# Altium schematic sheet main.SchDoc
size A4
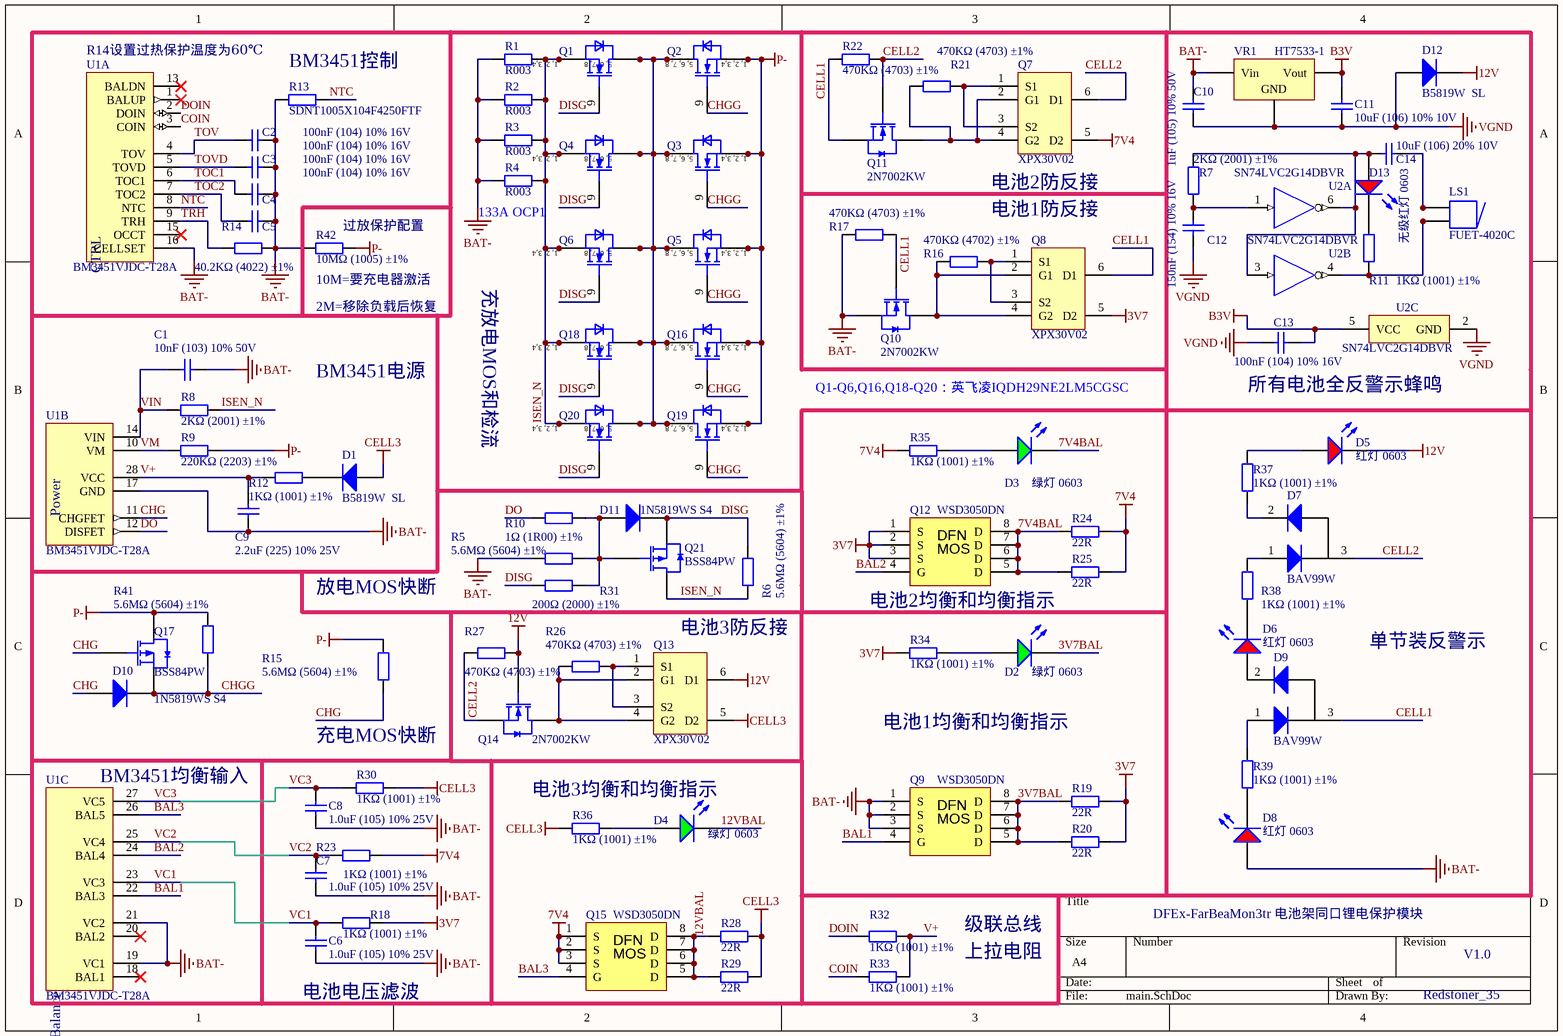
[diagram p0: main.SchDoc]

## Parts
C1  10nF (103) 10% 50V  [0402_C]
C2  100nF (104) 10% 16V  [0402_C]
C3  100nF (104) 10% 16V  [0402_C]
C4  100nF (104) 10% 16V  [0402_C]
C5  100nF (104) 10% 16V  [0402_C]
C6  1.0uF (105) 10% 25V  [0402_C]
C7  1.0uF (105) 10% 25V  [0402_C]
C8  1.0uF (105) 10% 25V  [0402_C]
C9  2.2uF (225) 10% 25V  [0402_C]
C10  1uF (105) 10% 50V  [0603_C]
C11  10uF (106) 10% 10V  [0603_C]
C12  150nF (154) 10% 16V  [0402_C]
C13  100nF (104) 10% 16V  [0402_C]
C14  10uF (106) 20% 10V  [0402_C]
D1  B5819W  SL  [SOD-123]
D2  绿灯 0603  [0603_LED_S1]
D3  绿灯 0603  [0603_LED_S1]
D4  绿灯 0603  [0603_LED_S1]
D5  红灯 0603  [0603_LED_S1]
D6  红灯 0603  [0603_LED_S1]
D7  BAV99W  [SC70-3]
D8  红灯 0603  [0603_LED_S1]
D9  BAV99W  [SC70-3]
D10  1N5819WS S4  [SOD-323]
D11  1N5819WS S4  [SOD-323]
D12  B5819W  SL  [SOD-123]
D13  无级红灯 0603  [0603_LED_S1]
LS1  FUET-4020C  [FUET-4020C]
Q1  IQDH29NE2LM5CGSC  [IFX-PG-WHTFN-9-2-V]  (value not drawn)
Q2  IQDH29NE2LM5CGSC  [IFX-PG-WHTFN-9-2-V]  (value not drawn)
Q3  IQDH29NE2LM5CGSC  [IFX-PG-WHTFN-9-2-V]  (value not drawn)
Q4  IQDH29NE2LM5CGSC  [IFX-PG-WHTFN-9-2-V]  (value not drawn)
Q5  IQDH29NE2LM5CGSC  [IFX-PG-WHTFN-9-2-V]  (value not drawn)
Q6  IQDH29NE2LM5CGSC  [IFX-PG-WHTFN-9-2-V]  (value not drawn)
Q7  XPX30V02  [EDFN3x3]
Q8  XPX30V02  [EDFN3x3]
Q9  WSD3050DN  [DFN-8_L3.0-W3.0-P0.65-BL]
Q10  2N7002KW  [SC70-3]
Q11  2N7002KW  [SC70-3]
Q12  WSD3050DN  [DFN-8_L3.0-W3.0-P0.65-BL]
Q13  XPX30V02  [EDFN3x3]
Q14  2N7002KW  [SC70-3]
Q15  WSD3050DN  [DFN-8_L3.0-W3.0-P0.65-BL]
Q16  IQDH29NE2LM5CGSC  [IFX-PG-WHTFN-9-2-V]  (value not drawn)
Q17  BSS84PW  [SC70-3]
Q18  IQDH29NE2LM5CGSC  [IFX-PG-WHTFN-9-2-V]  (value not drawn)
Q19  IQDH29NE2LM5CGSC  [IFX-PG-WHTFN-9-2-V]  (value not drawn)
Q20  IQDH29NE2LM5CGSC  [IFX-PG-WHTFN-9-2-V]  (value not drawn)
Q21  BSS84PW  [SC70-3]
R1  R003  [2512]
R2  R003  [2512]
R3  R003  [2512]
R4  R003  [2512]
R5  5.6MΩ (5604) ±1%  [0402_R]
R6  5.6MΩ (5604) ±1%  [0402_R]
R7  2KΩ (2001) ±1%  [0402_R]
R8  2KΩ (2001) ±1%  [0402_R]
R9  220KΩ (2203) ±1%  [0402_R]
R10  1Ω (1R00) ±1%  [0402_R]
R11  1KΩ (1001) ±1%  [0402_R]
R12  1KΩ (1001) ±1%  [0805_R]
R13  SDNT1005X104F4250FTF  [0402_R]
R14  40.2KΩ (4022) ±1%  [0402_R]
R15  5.6MΩ (5604) ±1%  [0402_R]
R16  470KΩ (4702) ±1%  [0402_R]
R17  470KΩ (4703) ±1%  [0402_R]
R18  1KΩ (1001) ±1%  [0402_R]
R19  22R  [1210R]
R20  22R  [1210R]
R21  470KΩ (4703) ±1%  [0402_R]
R22  470KΩ (4703) ±1%  [0402_R]
R23  1KΩ (1001) ±1%  [0402_R]
R24  22R  [1210R]
R25  22R  [1210R]
R26  470KΩ (4703) ±1%  [0402_R]
R27  470KΩ (4703) ±1%  [0402_R]
R28  22R  [1210R]
R29  22R  [1210R]
R30  1KΩ (1001) ±1%  [0402_R]
R31  200Ω (2000) ±1%  [0402_R]
R32  1KΩ (1001) ±1%  [0402_R]
R33  1KΩ (1001) ±1%  [0402_R]
R34  1KΩ (1001) ±1%  [0402_R]
R35  1KΩ (1001) ±1%  [0402_R]
R36  1KΩ (1001) ±1%  [0402_R]
R37  1KΩ (1001) ±1%  [0402_R]
R38  1KΩ (1001) ±1%  [0402_R]
R39  1KΩ (1001) ±1%  [0402_R]
R41  5.6MΩ (5604) ±1%  [0402_R]
R42  10MΩ (1005) ±1%  [0402_R]
U1  BM3451VJDC-T28A  [TSSOP28-BM3451]  (parts A,B,C of 3)
U2  SN74LVC2G14DBVR  [DBV0006A_N]  (parts A,B,C of 3)
VR1  HT7533-1  [SOT-89(SOT-89-3)]

## Nets
3V7: Q8.5(D2) Q12.1(S) Q12.2(S) Q12.3(S) R18.2 R19.1 R20.1 R34.1
7V4: Q7.5(D2) Q15.1(S) Q15.2(S) Q15.3(S) R23.2 R24.1 R25.1 R35.1
12V: D5.K D12.2(K) Q13.6(D1) Q14.1(G) R27.2
B3V: C11.2 C13.1 U2.5(VCC) VR1.3(Vout)
BAT-: C1.2 C2.2 C3.2 C4.2 C5.2 C6.1 C7.1 C8.1 C9.1 C10.2 D8.A Q9.1(S) Q9.2(S) Q9.3(S) Q10.2(S) R1.2 R2.2 R3.2 R4.2 R5.2 R13.2 R14.2 R17.1 R42.1 U1.16(CELLSET) U1.17(GND) U1.19(VC1) U1.21(VC2) VR1.2(Vin)
CELL3: D1.1(A) Q13.5(D2) R28.1 R29.1 R30.2 R36.1
P-: Q2.1(SOURCE1) Q2.2(SOURCE2) Q2.3(SOURCE3) Q2.4(SOURCE4) Q3.1(SOURCE1) Q3.2(SOURCE2) Q3.3(SOURCE3) Q3.4(SOURCE4) Q5.1(SOURCE1) Q5.2(SOURCE2) Q5.3(SOURCE3) Q5.4(SOURCE4) Q16.1(SOURCE1) Q16.2(SOURCE2) Q16.3(SOURCE3) Q16.4(SOURCE4) Q17.3(D) Q19.1(SOURCE1) Q19.2(SOURCE2) Q19.3(SOURCE3) Q19.4(SOURCE4) R9.2 R15.2 R41.2 R42.2
VGND: C10.1 C11.1 C12.2 C13.2 D12.1(A) U2.2(GND) VR1.1(GND)
3V7BAL: D2.K Q9.5(D) Q9.6(D) Q9.7(D) Q9.8(D) R19.2 R20.2
7V4BAL: D3.K Q12.5(D) Q12.6(D) Q12.7(D) Q12.8(D) R24.2 R25.2
12VBAL: D4.K Q15.5(D) Q15.6(D) Q15.7(D) Q15.8(D) R28.2 R29.2
BAL1: Q9.4(G) U1.22(BAL3)
BAL2: Q12.4(G) U1.24(BAL4)
BAL3: Q15.4(G) U1.26(BAL5)
CELL1: D9.3(K) Q8.6(D1) Q10.1(G) Q11.2(S) R17.2 R22.1
CELL2: D7.3(K) Q7.6(D1) Q11.1(G) Q14.2(S) R22.2 R27.1
CHG: D10.1(A) Q17.1(G) R15.1 U1.11(CHGFET)
CHGG: D10.2(K) Q2.9(GATE) Q3.9(GATE) Q5.9(GATE) Q16.9(GATE) Q17.2(S) Q19.9(GATE) R41.1
COIN: R33.1 U1.3(COIN)
DISG: D11.2(K) Q1.9(GATE) Q4.9(GATE) Q6.9(GATE) Q18.9(GATE) Q20.9(GATE) Q21.2(S) R6.2 R31.1
DO: R10.1 U1.12(DISFET)
DOIN: R32.1 U1.2(DOIN)
ISEN_N: Q1.1(SOURCE1) Q1.2(SOURCE2) Q1.3(SOURCE3) Q1.4(SOURCE4) Q4.1(SOURCE1) Q4.2(SOURCE2) Q4.3(SOURCE3) Q4.4(SOURCE4) Q6.1(SOURCE1) Q6.2(SOURCE2) Q6.3(SOURCE3) Q6.4(SOURCE4) Q18.1(SOURCE1) Q18.2(SOURCE2) Q18.3(SOURCE3) Q18.4(SOURCE4) Q20.1(SOURCE1) Q20.2(SOURCE2) Q20.3(SOURCE3) Q20.4(SOURCE4) Q21.3(D) R1.1 R2.1 R3.1 R4.1 R6.1 R8.2
NTC: R13.1 U1.8(NTC)
TOC1: C4.1 U1.6(TOC1)
TOC2: C5.1 U1.7(TOC2)
TOV: C2.1 U1.4(TOV)
TOVD: C3.1 U1.5(TOVD)
TRH: R14.1 U1.9(TRH)
V+: C9.2 R12.1 R32.2 R33.2 U1.28(VCC)
VC1: C6.2 R18.1 U1.23(VC3)
VC2: C7.2 R23.1 U1.25(VC4)
VC3: C8.2 R30.1 U1.27(VC5)
VIN: C1.1 R8.1 U1.14(VIN)
VM: R9.1 U1.10(VM)
NetC12_1: C12.1 R7.1 U2.1(1A)
NetC14_1: C14.1 D13.A R7.2 U2.3(2A) U2.6(1Y)
NetC14_2: C14.2 LS1.2 LS1.2A
NetD1_2: D1.2(K) R12.2
NetD2_A: D2.A R34.2
NetD3_A: D3.A R35.2
NetD4_A: D4.A R36.2
NetD5_A: D5.A R37.2
NetD6_A: D6.A D9.2(A)
NetD6_K: D6.K R38.1
NetD7_1: D7.1(A) R38.2
NetD7_2: D7.2(A) R37.1
NetD8_K: D8.K R39.1
NetD9_1: D9.1(A) R39.2
NetD11_1: D11.1(A) Q21.1(G) R5.1 R10.2 R31.2
NetD13_K: D13.K R11.2
NetLS1_1: LS1.1 LS1.1A R11.1 U2.4(2Y)
NetQ1_5: Q1.5(DRAIN1) Q1.6(DRAIN2) Q1.7(DRAIN3) Q1.8(DRAIN4) Q2.5(DRAIN1) Q2.6(DRAIN2) Q2.7(DRAIN3) Q2.8(DRAIN4) Q3.5(DRAIN1) Q3.6(DRAIN2) Q3.7(DRAIN3) Q3.8(DRAIN4) Q4.5(DRAIN1) Q4.6(DRAIN2) Q4.7(DRAIN3) Q4.8(DRAIN4) Q5.5(DRAIN1) Q5.6(DRAIN2) Q5.7(DRAIN3) Q5.8(DRAIN4) Q6.5(DRAIN1) Q6.6(DRAIN2) Q6.7(DRAIN3) Q6.8(DRAIN4) Q16.5(DRAIN1) Q16.6(DRAIN2) Q16.7(DRAIN3) Q16.8(DRAIN4) Q18.5(DRAIN1) Q18.6(DRAIN2) Q18.7(DRAIN3) Q18.8(DRAIN4) Q19.5(DRAIN1) Q19.6(DRAIN2) Q19.7(DRAIN3) Q19.8(DRAIN4) Q20.5(DRAIN1) Q20.6(DRAIN2) Q20.7(DRAIN3) Q20.8(DRAIN4)
NetQ7_1: Q7.1(S1) Q7.3(S2) R21.2
NetQ7_2: Q7.2(G1) Q7.4(G2) Q11.3(D) R21.1
NetQ8_1: Q8.1(S1) Q8.3(S2) R16.2
NetQ8_2: Q8.2(G1) Q8.4(G2) Q10.3(D) R16.1
NetQ13_1: Q13.1(S1) Q13.3(S2) R26.2
NetQ13_2: Q13.2(G1) Q13.4(G2) Q14.3(D) R26.1

Not connected (* = marked no-connect by the designer): U1 1(BALUP)* 13(BALDN)* 15(OCCT)* 18(BAL1)* 20(BAL2)*

## Notes on the sheet
- (near U1) R14设置过热保护温度为60℃
- (near R13) BM3451控制
- (near R42) 过放保护配置
- (near R4) 133A OCP1
- (near Q7) 电池2防反接
- 电池1防反接
- (near R42) 10M=要充电器激活
- 2M=移除负载后恢复
- 充放电MOS和检流
- BM3451电源
- Q1-Q6,Q16,Q18-Q20：英飞凌IQDH29NE2LM5CGSC
- 所有电池全反警示蜂鸣
- 放电MOS快断
- 电池3防反接
- (near Q12) 电池2均衡和均衡指示
- 单节装反警示
- (near U1) BM3451均衡输入
- 充电MOS快断
- 电池1均衡和均衡指示
- (near R36) 电池3均衡和均衡指示
- DFEx-FarBeaMon3tr 电池架同口锂电保护模块
- 级联总线
- 上拉电阻
- V1.0
- (near C6) 电池电压滤波
- Redstoner_35
- (in symbol BM3451-T28A, part A) CTRL
- (in symbol BM3451-T28A, part B) Power
- (in symbol BM3451-T28A, part C) Balance
- (in symbol IQDH29NE2LM5CGSC) 1, 2, 3,4; 5, 6, 7, 8
- (in symbol SON/DFN5x6 MOS) DFN; MOS

## Library data of the parts
C1 = 0402 10nF (103) 10% 50V: 贴片电容; ComponentLink1Description: 供应商链接; ComponentLink1URL: http://www.szlcsc.com/product/details_15869.html; Package: 0402; Supplier: LC; SuppliersPartNumber: C15195
C2-C5 C12 C13 = 0402 100nF (104) 10% 16V: 贴片电容; ComponentLink1Description: 供应商链接; ComponentLink1URL: http://www.szlcsc.com/product/details_1877.html; Package: 0402; Supplier: LC; SuppliersPartNumber: C1525
C6-C8 = 0402 1.0uF (105) 10% 25V: 贴片电容; ComponentLink1Description: 供应商链接; ComponentLink1URL: http://www.szlcsc.com/product/details_53938.html; Package: 0402; Supplier: LC; SuppliersPartNumber: C52923
C9 = 0402 2.2nF (222) 10% 50V: 贴片电容; ComponentLink1Description: 供应商链接; ComponentLink1URL: http://www.szlcsc.com/product/details_1883.html; Package: 0402; Supplier: LC; SuppliersPartNumber: C1531
C10 = 0603 1uF (105) 10% 50V: 贴片电容; ComponentLink1Description: 供应商链接; ComponentLink1URL: http://www.szlcsc.com/product/details_16531.html; Package: 0603; Supplier: LC; SuppliersPartNumber: C15849
C11 = 0603 10uF (106) 10% 10V: 贴片电容; ComponentLink1Description: 供应商链接; ComponentLink1URL: http://www.szlcsc.com/product/details_20411.html; Package: 0603; Supplier: LC; SuppliersPartNumber: C19702
C14 = 0402 10uF (106) 20% 6.3V: 贴片电容; ComponentLink1Description: 供应商链接; ComponentLink1URL: http://www.szlcsc.com/product/details_16204.html; Package: 0402; Supplier: LC; SuppliersPartNumber: C15525
D1 D12 = SOD-123 B5819W  SL: 肖特基二极管; ComponentLink1Description: 供应商链接; ComponentLink1URL: http://www.szlcsc.com/product/details_9093.html; Package: SOD-123; Supplier: LC; SuppliersPartNumber: C8598
D2-D4 = 0603 绿灯: 发光二极管; ComponentLink1Description: 供应商链接; ComponentLink1URL: http://www.szlcsc.com/product/details_73152.html; Package: 0603; Supplier: LC; SuppliersPartNumber: C72043
D5 D6 D8 D13 = 0603 红灯: 发光二极管; ComponentLink1Description: 供应商链接; ComponentLink1URL: http://www.szlcsc.com/product/details_2659.html; Package: 0603; Supplier: LC; SuppliersPartNumber: C2286
D7 D9 = SOT-23 BAV99 A7W: 开关二极管; ComponentLink1Description: 供应商链接; ComponentLink1URL: http://www.szlcsc.com/product/details_2877.html; Package: SOT-23; Supplier: LC; SuppliersPartNumber: C2500
D10 D11 = SOD-323 1N4148WS T4: 二极管; ComponentLink1Description: 供应商链接; ComponentLink1URL: http://www.szlcsc.com/product/details_2485.html; Package: SOD-323; Supplier: LC; SuppliersPartNumber: C2128
LS1 = Buzzer: 福声科技有限公司侧发声电磁式蜂鸣器，4*4*2mm尺寸; Published: 24-Mar-1999; LatestRevisionDate: 17-Dec-2003; LatestRevisionNote: Schematic revised, PCB Footprint replaced.; DatasheetVersion: 17-Dec-2003; PackageReference: ABSM-1574; Publisher: Altium Limited; PackageDescription: Magnetic Transducer Buzzer; ComponentLink1Description: Manufacturer Link; ComponentLink1URL: http://www.megastar.com/linecard/buzzmode/index.php
Q1-Q6 Q16 Q18-Q20 = IQDH29NE2LM5CGSC: Insulated-Gate Field-Effect Transistor (IGFET), N-Channel, Enhancement, Body Diode, Pin 1 Source, 2 Source, 3 Source, 4 Sourse, 5 Drain, 6 Drain, 7 Drain, 8 Drain, 9 Gate, 9 Pins; Manufacturer: Infineon Technologies; PackageReference: PG-WHTFN-9-2; Manufacturer Order Number: IQDH29NE2LM5CGSC
Q7 Q8 Q13 = XPX10H03RX: 双N沟道MOSFET, DFN3x3 30V 40A 10mΩ
Q9 Q12 Q15 = SON/DFN5x6 MOS: PDFN3x3 20V 50A 5.8mΩ N-Ch MOSFET
Q10 Q11 Q14 = 2N7002 7002: 单N沟道MOSFET(场效应管); ComponentLink1Description: 供应商链接; ComponentLink1URL: http://www.szlcsc.com/product/details_9040.html; Package: SOT-323; Supplier: LC; SuppliersPartNumber: C???????
Q17 Q21 = SI2301CDS-T1-GE3: MOS(场效应管); ComponentLink1Description: 供应商链接; ComponentLink1URL: http://www.szlcsc.com/product/details_11030.html; Package: SOT-23(SOT-23-3); Supplier: LC; SuppliersPartNumber: C10487
R1-R4 = Res: 2512尺寸 3W 3mΩ ±1% 合金检流电阻; Value: BVT-I-R003-1.0; Published: 8-Jun-2000; LatestRevisionDate: 17-Jul-2002; LatestRevisionNote: Re-released for DXP Platform.; PackageReference: AXIAL-0.4; Publisher: Altium Limited; PackageDescription: Axial Device, Thru-Hole; 2 Leads; 0.4 in Pin Spacing
R5 R6 R15 R41 = 0402 1MΩ (1004) 1%: 贴片电阻; ComponentLink1Description: 供应商链接; ComponentLink1URL: http://www.szlcsc.com/product/details_26826.html; Package: 0402; Supplier: LC; SuppliersPartNumber: C26083
R7 R11 R18 R23 R30 R32-R39 = 0402 1KΩ (1001) 1%: 贴片电阻; ComponentLink1Description: 供应商链接; ComponentLink1URL: http://www.szlcsc.com/product/details_12256.html; Package: 0402; Supplier: LC; SuppliersPartNumber: C11702
R8 = 0402 2KΩ (2001) 1%: 贴片电阻; ComponentLink1Description: 供应商链接; ComponentLink1URL: http://www.szlcsc.com/product/details_4516.html; Package: 0402; Supplier: LC; SuppliersPartNumber: C4109
R9 = 0402 220KΩ (2203) 1%: 贴片电阻; ComponentLink1Description: 供应商链接; ComponentLink1URL: http://www.szlcsc.com/product/details_26510.html; Package: 0402; Supplier: LC; SuppliersPartNumber: C25767
R10 = 0402 1Ω (1R00) 1%: 贴片电阻; ComponentLink1Description: 供应商链接; ComponentLink1URL: http://www.szlcsc.com/product/details_25829.html; Package: 0402; Supplier: LC; SuppliersPartNumber: C25086
R12 = 0805 1KΩ (1001) 1%: 贴片电阻; ComponentLink1Description: 供应商链接; ComponentLink1URL: http://www.szlcsc.com/product/details_18201.html; Package: 0805; Supplier: LC; SuppliersPartNumber: C17513
R13 = 0402 100KΩ (1003) 1%: 贴片NTC热敏电阻 100KΩ (1003) ±1% B4250; ComponentLink1Description: 供应商链接; ComponentLink1URL: http://www.szlcsc.com/product/details_26484.html; Package: 0402; Supplier: LC; SuppliersPartNumber: C25741
R14 = 0402 56KΩ (5602) 1%: 贴片电阻; ComponentLink1Description: 供应商链接; ComponentLink1URL: http://www.szlcsc.com/product/details_26539.html; Package: 0402; Supplier: LC; SuppliersPartNumber: C25796
R16 = 0402 20KΩ (2002) 1%: 贴片电阻; ComponentLink1Description: 供应商链接; ComponentLink1URL: http://www.szlcsc.com/product/details_26508.html; Package: 0402; Supplier: LC; SuppliersPartNumber: C25765
R17 R21 R22 R26 R27 = 0402 470KΩ (4703) 1%: 贴片电阻; ComponentLink1Description: 供应商链接; ComponentLink1URL: http://www.szlcsc.com/product/details_26533.html; Package: 0402; Supplier: LC; SuppliersPartNumber: C25790
R19 R20 R24 R25 R28 R29 = Res: Resistor; Published: 8-Jun-2000; LatestRevisionDate: 17-Jul-2002; LatestRevisionNote: Re-released for DXP Platform.; PackageReference: AXIAL-0.4; Publisher: Altium Limited; PackageDescription: Axial Device, Thru-Hole; 2 Leads; 0.4 in Pin Spacing; Value: 22R
R31 = 0402 200Ω (2000) 1%: 贴片电阻; ComponentLink1Description: 供应商链接; ComponentLink1URL: http://www.szlcsc.com/product/details_25830.html; Package: 0402; Supplier: LC; SuppliersPartNumber: C25087
R42 = 0402 10MΩ (1005) 1%: 贴片电阻; ComponentLink1Description: 供应商链接; ComponentLink1URL: http://www.szlcsc.com/product/details_26825.html; Package: 0402; Supplier: LC; SuppliersPartNumber: C26082
U1 = BM3451-T28A: 2-5串全功能锂电池保护IC，支持级联功能
U2 = SN74LVC2G14DBVR: Dual Schmitt-Trigger Inverter, DBV0006A, LARGE T&R; Manufacturer: Texas Instruments; VCC(Min)(V): 1.65; VCC(Max)(V): 5.5; Output Type: CMOS; ICC @ Nom Voltage(Max)(mA): 0.01; Input Type: CMOS/TTL; Bits(#): 2; F @ Nom Voltage(Max)(Mhz): 150; Rating: Catalog; Technology Family: LVC; Voltage(Nom)(V): 1.8,2.5,3.3,5; Schmitt Trigger: Yes; Output Drive (IOL/IOH)(Max)(mA): 32/-32; tpd @ Nom Voltage(Max)(ns): 9.5,5.7,5.4,4.3; Logic: Inverting; Sub-Family: Inverting Buffer/Driver; 3-State Output: No; DatasheetVersion: SCES200M; PackageReference: DBV0006A; Supplier 1: Mouser; Supplier Part Number 1: 595-SN74LVC2G14DBVR; Supplier 2: Digi-Key; Supplier Part Number 2: 296-13010-2-ND; Supplier 3: Digi-Key; Supplier Part Number 3: 296-13010-1-ND; Supplier 4: Digi-Key; Supplier Part Number 4: 296-13010-6-ND; Generic Part Number: SN74LVC2G14; Operating Temperature Range(C): -40 to 125; PartNumber: SN74LVC2G14DBVR; ComponentLink1Description: Manufacturer URL; ComponentLink1URL: http://www.ti.com/; ComponentLink2Description: Datasheet; ComponentLink2URL: http://www.ti.com/lit/ds/symlink/sn74lvc2g14.pdf
VR1 = SOT-89 HT7533-1: 低压差线性稳压(LDO); ComponentLink1Description: 供应商链接; ComponentLink1URL: http://www.szlcsc.com/product/details_14949.html; Package: SOT-89; Supplier: LC; SuppliersPartNumber: C14289